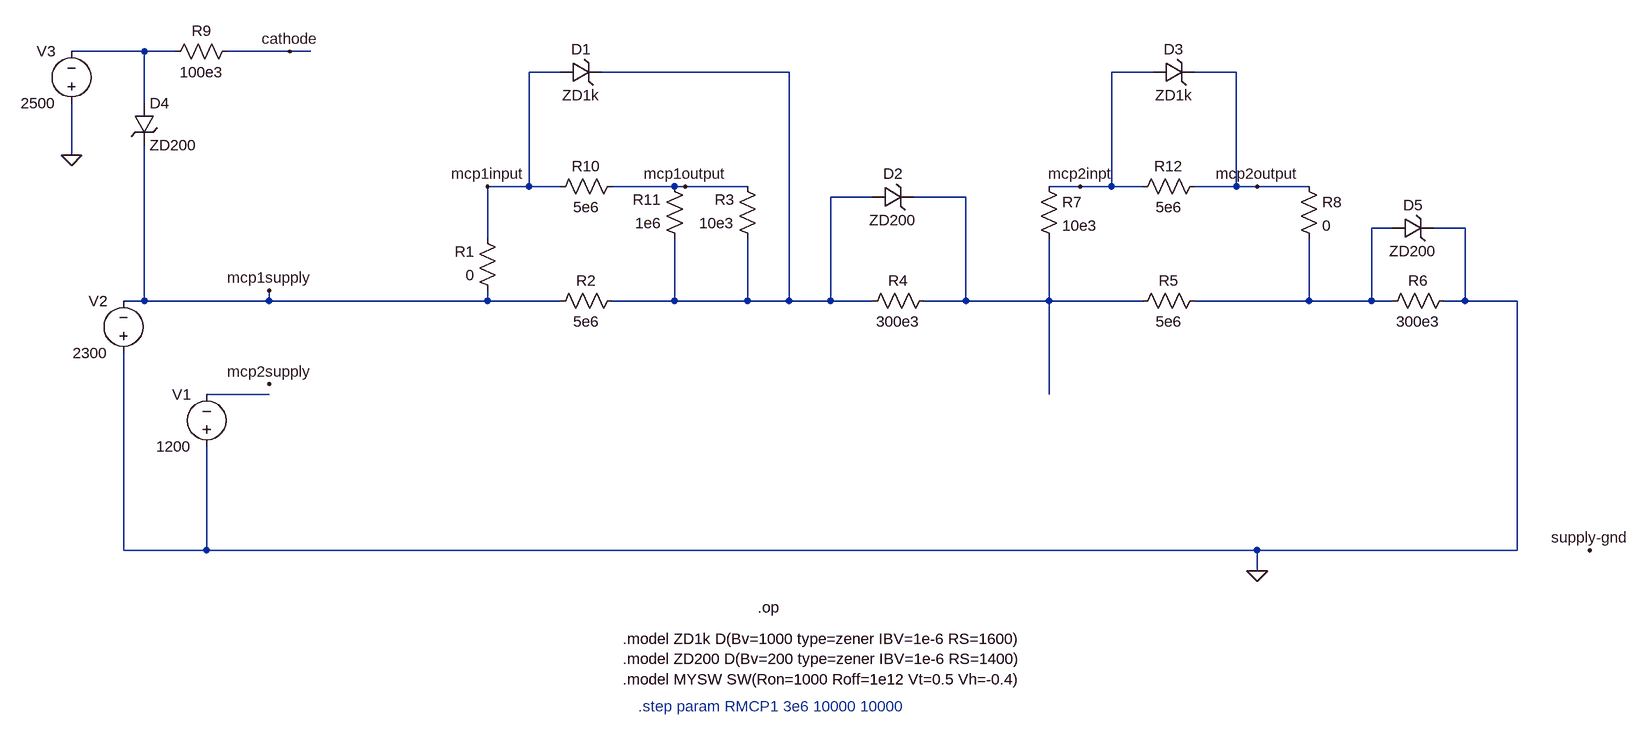
[diagram p0: schematic resistive.asc]
resistive.asc, the LTspice schematic file:
Version 4
SHEET 1 1928 944
WIRE -368 -80 -480 -80
WIRE -320 -80 -368 -80
WIRE -144 -80 -240 -80
WIRE -112 -80 -144 -80
WIRE 272 -48 224 -48
WIRE 624 -48 336 -48
WIRE 1184 -48 1120 -48
WIRE 1312 -48 1248 -48
WIRE -368 0 -368 -80
WIRE -480 80 -480 0
WIRE 224 128 224 -48
WIRE 224 128 160 128
WIRE 272 128 224 128
WIRE 448 128 352 128
WIRE 464 128 448 128
WIRE 560 128 464 128
WIRE 1072 128 1024 128
WIRE 1120 128 1120 -48
WIRE 1120 128 1072 128
WIRE 1168 128 1120 128
WIRE 1312 128 1312 -48
WIRE 1312 128 1248 128
WIRE 1344 128 1312 128
WIRE 1424 128 1344 128
WIRE 752 144 688 144
WIRE 896 144 816 144
WIRE 1552 192 1520 192
WIRE 1664 192 1616 192
WIRE 160 208 160 128
WIRE -368 304 -368 64
WIRE -368 304 -400 304
WIRE -176 304 -176 288
WIRE -176 304 -368 304
WIRE 160 304 160 288
WIRE 160 304 -176 304
WIRE 272 304 160 304
WIRE 448 304 448 208
WIRE 448 304 352 304
WIRE 560 304 560 208
WIRE 560 304 448 304
WIRE 624 304 624 -48
WIRE 624 304 560 304
WIRE 688 304 688 144
WIRE 688 304 624 304
WIRE 752 304 688 304
WIRE 896 304 896 144
WIRE 896 304 832 304
WIRE 1024 304 1024 208
WIRE 1024 304 896 304
WIRE 1168 304 1024 304
WIRE 1424 304 1424 208
WIRE 1424 304 1248 304
WIRE 1520 304 1520 192
WIRE 1520 304 1424 304
WIRE 1552 304 1520 304
WIRE 1664 304 1664 192
WIRE 1664 304 1632 304
WIRE 1744 304 1664 304
WIRE -176 448 -272 448
WIRE 1024 448 1024 304
WIRE -400 688 -400 384
WIRE -272 688 -272 528
WIRE -272 688 -400 688
WIRE 1344 688 -272 688
WIRE 1744 688 1744 304
WIRE 1744 688 1344 688
WIRE 1344 720 1344 688
FLAG 1856 688 supply-gnd
FLAG 160 128 mcp1input
FLAG 464 128 mcp1output
FLAG 1072 128 mcp2inpt
FLAG 1344 128 mcp2output
FLAG 1344 720 0
FLAG -176 288 mcp1supply
FLAG -176 432 mcp2supply
FLAG -480 80 0
FLAG -144 -80 cathode
SYMBOL res 176 304 R180
WINDOW 0 36 76 Left 2
WINDOW 3 36 40 Left 2
SYMATTR InstName R1
SYMATTR Value 0
SYMBOL res 368 288 R90
WINDOW 0 0 56 VBottom 2
WINDOW 3 32 56 VTop 2
SYMATTR InstName R2
SYMATTR Value 5e6
SYMBOL res 576 224 R180
WINDOW 0 36 76 Left 2
WINDOW 3 36 40 Left 2
SYMATTR InstName R3
SYMATTR Value 10e3
SYMBOL res 736 320 R270
WINDOW 0 32 56 VTop 2
WINDOW 3 0 56 VBottom 2
SYMATTR InstName R4
SYMATTR Value 300e3
SYMBOL res 1152 320 R270
WINDOW 0 32 56 VTop 2
WINDOW 3 0 56 VBottom 2
SYMATTR InstName R5
SYMATTR Value 5e6
SYMBOL res 1536 320 R270
WINDOW 0 32 56 VTop 2
WINDOW 3 0 56 VBottom 2
SYMATTR InstName R6
SYMATTR Value 300e3
SYMBOL res 1008 112 R0
SYMATTR InstName R7
SYMATTR Value 10e3
SYMBOL res 1408 112 R0
SYMATTR InstName R8
SYMATTR Value 0
SYMBOL res -224 -96 R90
WINDOW 0 0 56 VBottom 2
WINDOW 3 32 56 VTop 2
SYMATTR InstName R9
SYMATTR Value 100e3
SYMBOL res 368 112 R90
WINDOW 0 0 56 VBottom 2
WINDOW 3 32 56 VTop 2
SYMATTR InstName R10
SYMATTR Value 5e6
SYMBOL res 1264 112 R90
WINDOW 0 0 56 VBottom 2
WINDOW 3 32 56 VTop 2
SYMATTR InstName R12
SYMATTR Value 5e6
SYMBOL zener 272 -32 R270
WINDOW 0 36 32 VTop 2
WINDOW 3 -4 32 VBottom 2
SYMATTR InstName D1
SYMATTR Value ZD1k
SYMBOL voltage -272 544 R180
WINDOW 0 24 96 Left 2
WINDOW 3 24 16 Left 2
SYMATTR InstName V1
SYMATTR Value 1200
SYMBOL zener 752 160 R270
WINDOW 0 36 32 VTop 2
WINDOW 3 -4 32 VBottom 2
SYMATTR InstName D2
SYMATTR Value ZD200
SYMBOL voltage -400 400 R180
WINDOW 0 24 96 Left 2
WINDOW 3 24 16 Left 2
SYMATTR InstName V2
SYMATTR Value 2300
SYMBOL voltage -480 16 R180
WINDOW 0 24 96 Left 2
WINDOW 3 24 16 Left 2
SYMATTR InstName V3
SYMATTR Value 2500
SYMBOL zener -384 0 R0
SYMATTR InstName D4
SYMATTR Value ZD200
SYMBOL zener 1184 -32 R270
WINDOW 0 36 32 VTop 2
WINDOW 3 -4 32 VBottom 2
SYMATTR InstName D3
SYMATTR Value ZD1k
SYMBOL zener 1552 208 R270
WINDOW 0 36 32 VTop 2
WINDOW 3 -4 32 VBottom 2
SYMATTR InstName D5
SYMATTR Value ZD200
SYMBOL res 464 224 R180
WINDOW 0 36 76 Left 2
WINDOW 3 36 40 Left 2
SYMATTR InstName R11
SYMATTR Value 1e6
TEXT 368 824 Left 2 !.model ZD1k D(Bv=1000 type=zener IBV=1e-6 RS=1600)\n.model ZD200 D(Bv=200 type=zener IBV=1e-6 RS=1400)\n.model MYSW SW(Ron=1000 Roff=1e12 Vt=0.5 Vh=-0.4)
TEXT 576 776 Left 2 !.op
TEXT 392 928 Left 2 ;.step param RMCP1 3e6 10000 10000

The netlist it stands for:
* resistive.asc
R1 mcp1supply mcp1input 0
R2 N002 mcp1supply 5e6
R3 N002 mcp1output 10e3
R4 N002 N003 300e3
R5 N003 N004 5e6
R6 N004 0 300e3
R7 mcp2inpt N003 10e3
R8 mcp2output N004 0
R9 cathode N001 100e3
R10 mcp1output mcp1input 5e6
R12 mcp2output mcp2inpt 5e6
D1 mcp1input N002 ZD1k
V1 0 N005 1200
D2 N002 N003 ZD200
V2 0 mcp1supply 2300
V3 0 N001 2500
D4 N001 mcp1supply ZD200
D3 mcp2inpt mcp2output ZD1k
D5 N004 0 ZD200
R11 N002 mcp1output 1e6
.model D D
.lib standard.dio
.model ZD1k D(Bv=1000 type=zener IBV=1e-6 RS=1600)
.model ZD200 D(Bv=200 type=zener IBV=1e-6 RS=1400)
.model MYSW SW(Ron=1000 Roff=1e12 Vt=0.5 Vh=-0.4)
.op
* .step param RMCP1 3e6 10000 10000
.backanno
.end